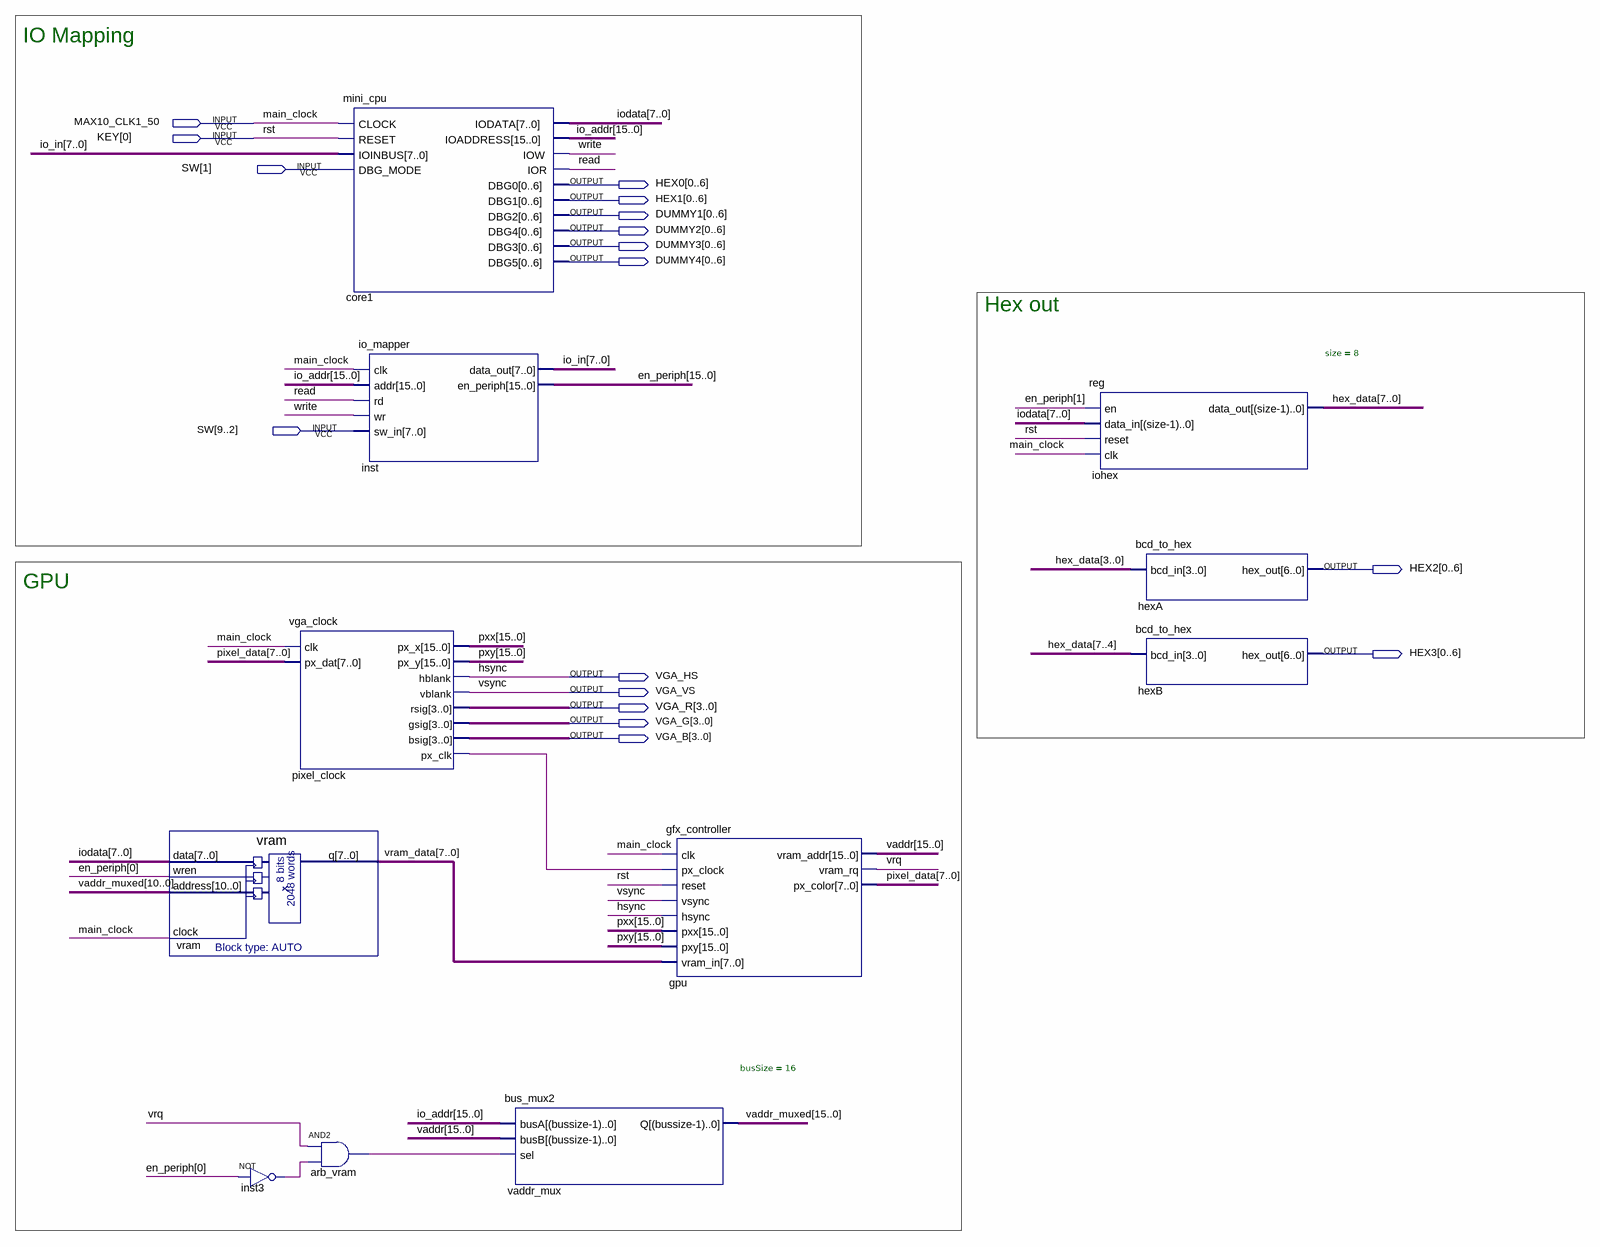
[diagram p0: schematic sheet]
// Quartus schematic system.bdf as structural Verilog: 11 symbols, 17 pins
module system (
  input  MAX10_CLK1_50,
  input  [0:0] KEY,
  input  [9:1] SW,
  output [0:6] HEX0,
  output [0:6] HEX1,
  output [0:6] DUMMY1,
  output [0:6] DUMMY2,
  output [0:6] DUMMY3,
  output [0:6] DUMMY4,
  output [0:6] HEX2,
  output [0:6] HEX3,
  output VGA_HS,
  output VGA_VS,
  output [3:0] VGA_R,
  output [3:0] VGA_G,
  output [3:0] VGA_B
);

  wire arb_vram_out, inst3_out, pixel_clock_px_clk, read, vrq, write;
  wire [7:0] hex_data, io_in, iodata, pixel_data, vram_data;
  wire [15:0] en_periph, io_addr, pxx, pxy, vaddr, vaddr_muxed;

  vram vram (.data(iodata), .wren(en_periph[0]), .address(vaddr_muxed[10:0]), .clock(MAX10_CLK1_50), .q(vram_data));
  not inst3 (inst3_out, en_periph[0]);
  vga_clock pixel_clock (
    .clk(MAX10_CLK1_50), .px_dat(pixel_data), .px_x(pxx), .px_y(pxy), .hblank(VGA_HS), .vblank(VGA_VS),
    .rsig(VGA_R), .gsig(VGA_G), .bsig(VGA_B), .px_clk(pixel_clock_px_clk));
  mini_cpu core1 (
    .CLOCK(MAX10_CLK1_50), .RESET(KEY[0]), .IOINBUS(io_in), .DBG_MODE(SW[1]), .IODATA(iodata),
    .IOADDRESS(io_addr), .IOW(write), .IOR(read), .DBG0(HEX0), .DBG1(HEX1), .DBG2(DUMMY1), .DBG4(DUMMY2),
    .DBG3(DUMMY3), .DBG5(DUMMY4));
  io_mapper inst (
    .clk(MAX10_CLK1_50), .addr(io_addr), .rd(read), .wr(write), .sw_in(SW[9:2]), .data_out(io_in),
    .en_periph(en_periph));
  and arb_vram (arb_vram_out, vrq, inst3_out);
  bus_mux2 #(.busSize(16)) vaddr_mux (.busA(io_addr), .busB(vaddr), .sel(arb_vram_out), .Q(vaddr_muxed));
  gfx_controller gpu (
    .clk(MAX10_CLK1_50), .px_clock(pixel_clock_px_clk), .reset(KEY[0]), .vsync(VGA_VS), .hsync(VGA_HS),
    .pxx(pxx), .pxy(pxy), .vram_in(vram_data), .vram_addr(vaddr), .vram_rq(vrq), .px_color(pixel_data));
  \reg  #(.size(8)) iohex (
    .en(en_periph[1]), .data_in(iodata), .reset(KEY[0]), .clk(MAX10_CLK1_50), .data_out(hex_data));
  bcd_to_hex hexA (.bcd_in(hex_data[3:0]), .hex_out(HEX2));
  bcd_to_hex hexB (.bcd_in(hex_data[7:4]), .hex_out(HEX3));

  // Other names for the same wires on the sheet: hsync = VGA_HS; main_clock = MAX10_CLK1_50; rst = KEY[0];
  //   vsync = VGA_VS

  // Notes on the sheet:
  //   IO Mapping
  //   Hex out
  //   GPU
endmodule
